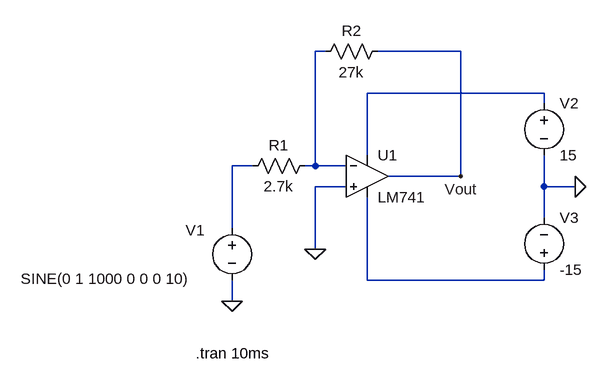
[diagram p0: schematic inverting_opa.asc]
inverting_opa.asc, the LTspice schematic file:
Version 4
SHEET 1 880 680
WIRE 144 -32 128 -32
WIRE 352 -32 224 -32
WIRE 480 32 208 32
WIRE 480 48 480 32
WIRE 208 128 208 32
WIRE 32 144 0 144
WIRE 128 144 128 -32
WIRE 128 144 112 144
WIRE 176 144 128 144
WIRE 352 160 352 -32
WIRE 352 160 240 160
WIRE 176 176 128 176
WIRE 480 176 480 128
WIRE 528 176 480 176
WIRE 480 224 480 176
WIRE 0 240 0 144
WIRE 128 272 128 176
WIRE 208 320 208 192
WIRE 480 320 480 304
WIRE 480 320 208 320
WIRE 0 352 0 320
FLAG 528 176 0
FLAG 352 160 Vout
FLAG 0 352 0
FLAG 128 272 0
SYMBOL OpAmps\\LM741 208 96 R0
SYMATTR InstName U1
SYMBOL voltage 0 224 R0
WINDOW 3 -325 94 Left 2
WINDOW 123 0 0 Left 0
WINDOW 39 0 0 Left 0
WINDOW 0 -71 19 Left 2
SYMATTR Value SINE(0 1 1000 0 0 0 10)
SYMATTR InstName V1
SYMBOL voltage 480 32 R0
WINDOW 123 0 0 Left 0
WINDOW 39 0 0 Left 0
SYMATTR InstName V2
SYMATTR Value 15
SYMBOL voltage 480 320 M180
WINDOW 0 24 96 Left 2
WINDOW 3 24 16 Left 2
WINDOW 123 0 0 Left 0
WINDOW 39 0 0 Left 0
SYMATTR InstName V3
SYMATTR Value -15
SYMBOL res 128 128 R90
WINDOW 0 0 56 VBottom 2
WINDOW 3 32 56 VTop 2
SYMATTR InstName R1
SYMATTR Value 2.7k
SYMBOL res 240 -48 R90
WINDOW 0 0 56 VBottom 2
WINDOW 3 32 56 VTop 2
SYMATTR InstName R2
SYMATTR Value 27k
TEXT -56 432 Left 2 !.tran 10ms

The netlist it stands for:
* inverting_opa.asc
XU1 0 N001 N002 N004 Vout LM741  ; pins In+ In- V+ V- OUT
V1 N003 0 SINE(0 1 1000 0 0 0 10)
V2 N002 0 15
V3 N004 0 -15
R1 N001 N003 2.7k
R2 Vout N001 27k
.tran 10ms
.lib LM741.lib
.backanno
.end